# Altium schematic sheet Sheet1_TLK.SchDoc
size A4 portrait; SheetNumber: 1; SheetTotal: 1
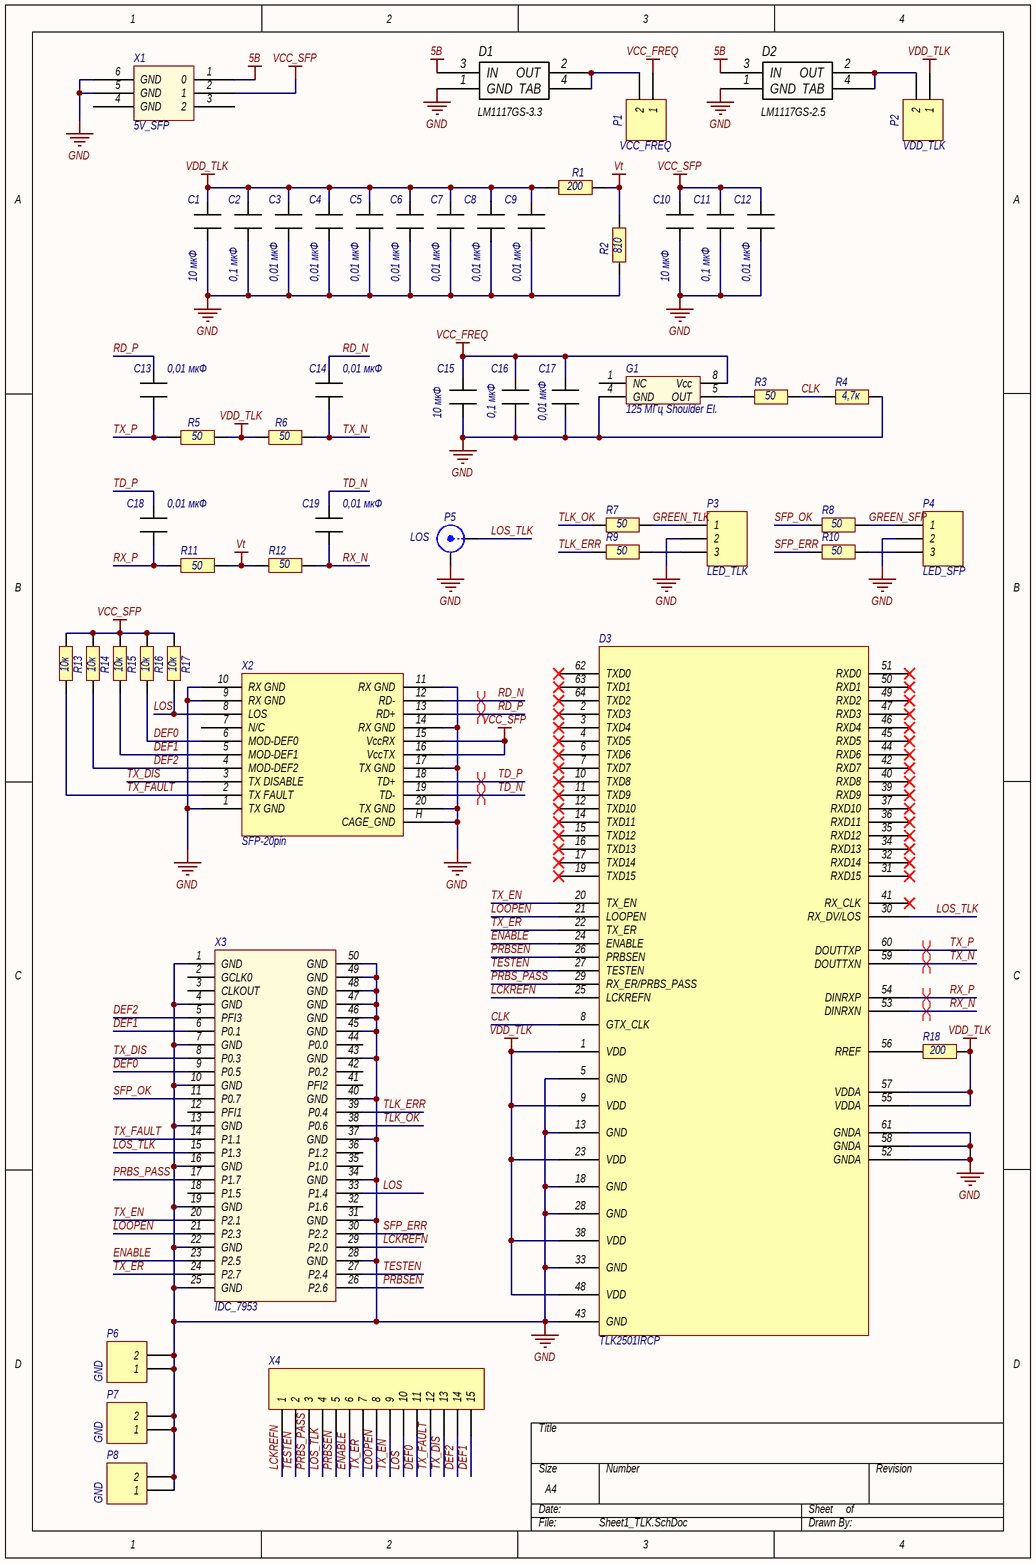
[diagram p0: Sheet1_TLK.SchDoc]

## Parts
C1  10 мкФ  [Cap_BIG]
C2  0,1 мкФ  [CAP_SMALL]
C3  0,01 мкФ  [CAP_SMALL]
C4  0,01 мкФ  [CAP_SMALL]
C5  0,01 мкФ  [CAP_SMALL]
C6  0,01 мкФ  [CAP_SMALL]
C7  0,01 мкФ  [CAP_SMALL]
C8  0,01 мкФ  [CAP_SMALL]
C9  0,01 мкФ  [CAP_SMALL]
C10  10 мкФ  [Cap_BIG]
C11  0,1 мкФ  [CAP_SMALL]
C12  0,01 мкФ  [CAP_SMALL]
C13  0,01 мкФ  [CAP_SMALL]
C14  0,01 мкФ  [CAP_SMALL]
C15  10 мкФ  [Cap_BIG]
C16  0,1 мкФ  [CAP_SMALL]
C17  0,01 мкФ  [CAP_SMALL]
C18  0,01 мкФ  [CAP_SMALL]
C19  0,01 мкФ  [CAP_SMALL]
D1  LM1117GS-3.3  [LM1117_SOT223]
D2  LM1117GS-2.5  [LM1117_SOT223]
D3  TLK2501IRCP  [Quad64]
G1  125 МГц Shoulder El.  [HALF]
P1  VCC_FREQ  [HDR1X2]
P2  VDD_TLK  [HDR1X2]
P3  LED_TLK  [HDR1X3]
P4  LED_SFP  [HDR1X3]
P5  LOS  [BNC_RA CON]
P6  GND  [HDR1X2]
P7  GND  [HDR1X2]
P8  GND  [HDR1X2]
R1  200  [RES]
R2  810  [RES]
R3  50  [RES]
R4  4,7к  [RES]
R5  50  [RES]
R6  50  [RES]
R7  50  [RES]
R8  50  [RES]
R9  50  [RES]
R10  50  [RES]
R11  50  [RES]
R12  50  [RES]
R13  10к  [RES]
R14  10к  [RES]
R15  10к  [RES]
R16  10к  [RES]
R17  10к  [RES]
R18  200  [RES]
X1  5V_SFP  [POWER]
X2  SFP-20pin  [SFP-20pin]
X3  IDC_7953  [IDC_7953]
X4  Header 15  [HDR1X15]  (value not drawn)

## Nets
5В: D1.3(IN) D2.3(IN) X1.1(0)
GND: C1.1 C2.1 C3.1 C4.1 C5.1 C6.1 C7.1 C8.1 C9.1 C10.1 C11.1 C12.1 C15.1 C16.1 C17.1 D1.1(GND) D2.1(GND) D3.5(GND) D3.13(GND) D3.18(GND) D3.28(GND) D3.33(GND) D3.43(GND) D3.52(GNDA) D3.58(GNDA) D3.61(GNDA) G1.4(GND) P3.2 P4.2 P5.2(Y) P6.1 P6.2 P7.1 P7.2 P8.1 P8.2 R2.1 R4.2 X1.5(GND) X1.6(GND) X2.1(TX_GND) X2.9(RX_GND) X2.10(RX_GND) X2.11(RX_GND) X2.14(RX_GND) X2.17(TX_GND) X2.20(TX_GND) X2.H(CAGE_GND) X3.1(GND) X3.4(GND) X3.7(GND) X3.10(GND) X3.13(GND) X3.16(GND) X3.19(GND) X3.22(GND) X3.25(GND) X3.28(GND) X3.31(GND) X3.34(GND) X3.37(GND) X3.40(GND) X3.43(GND) X3.45(GND) X3.46(GND) X3.47(GND) X3.48(GND) X3.49(GND) X3.50(GND)
VCC_FREQ: C15.2 C16.2 C17.2 G1.8(Vcc) P1.1
VCC_SFP: C10.2 C11.2 C12.2 R13.2 R14.2 R15.2 R16.2 R17.2 X1.2(1) X2.15(VccRX) X2.16(VccTX)
VDD_TLK: C1.2 C2.2 C3.2 C4.2 C5.2 C6.2 C7.2 C8.2 C9.2 D3.1(VDD) D3.9(VDD) D3.23(VDD) D3.38(VDD) D3.48(VDD) D3.55(VDDA) D3.57(VDDA) P2.1 R1.2 R5.2 R6.1 R18.2
Vt: R1.1 R2.2 R11.2 R12.1
CLK: D3.8(GTX_CLK) R3.2 R4.1
DEF0: R16.1 X2.6(MOD-DEF0) X3.9(P0.5) X4.11
DEF1: R15.1 X2.5(MOD-DEF1) X3.6(P0.1) X4.15
DEF2: R14.1 X2.4(MOD-DEF2) X3.5(PFI3) X4.14
ENABLE: D3.24(ENABLE) X3.23(P2.5) X4.6
GREEN_SFP: P4.1 R8.2
GREEN_TLK: P3.1 R7.2
LCKREFN: D3.25(LCKREFN) X3.29(P2.0) X4.1
LOOPEN: D3.21(LOOPEN) X3.21(P2.3) X4.8
LOS: R17.1 X2.8(LOS) X3.33(P1.4) X4.10
LOS_TLK: D3.30(RX_DV/LOS) P5.1(X) X3.15(P1.3) X4.4
PRBS_PASS: D3.29(RX_ER/PRBS_PASS) X3.17(P1.7) X4.3
PRBSEN: D3.26(PRBSEN) X3.26(P2.6) X4.5
RD_N: C14.2 X2.12(RD-)
RD_P: C13.2 X2.13(RD+)
RX_N: C19.1 D3.53(DINRXN) R12.2
RX_P: C18.1 D3.54(DINRXP) R11.1
SFP_ERR: R10.1 X3.30(P2.2)
SFP_OK: R8.1 X3.11(P0.7)
TD_N: C19.2 X2.19(TD-)
TD_P: C18.2 X2.18(TD+)
TESTEN: D3.27(TESTEN) X3.27(P2.4) X4.2
TLK_ERR: R9.1 X3.39(P0.4)
TLK_OK: R7.1 X3.38(P0.6)
TX_DIS: X2.3(TX_DISABLE) X3.8(P0.3) X4.13
TX_EN: D3.20(TX_EN) X3.20(P2.1) X4.9
TX_ER: D3.22(TX_ER) X3.24(P2.7) X4.7
TX_FAULT: R13.1 X2.2(TX_FAULT) X3.14(P1.1) X4.12
TX_N: C14.1 D3.59(DOUTTXN) R6.2
TX_P: C13.1 D3.60(DOUTTXP) R5.1
NetD1_2: D1.2(OUT) D1.4(TAB) P1.2
NetD2_2: D2.2(OUT) D2.4(TAB) P2.2
NetD3_56: D3.56(RREF) R18.1
NetG1_5: G1.5(OUT) R3.1
NetP3_3: P3.3 R9.2
NetP4_3: P4.3 R10.2

Not connected (* = marked no-connect by the designer): D3 2(TXD3)* 3(TXD4)* 4(TXD5)* 6(TXD6)* 7(TXD7)* 10(TXD8)* 11(TXD9)* 12(TXD10)* 14(TXD11)* 15(TXD12)* 16(TXD13)* 17(TXD14)* 19(TXD15)* 31(RXD15)* 32(RXD14)* 34(RXD13)* 35(RXD12)* 36(RXD11)* 37(RXD10)* 39(RXD9)* 40(RXD8)* 41(RX_CLK)* 42(RXD7)* 44(RXD6)* 45(RXD5)* 46(RXD4)* 47(RXD3)* 49(RXD2)* 50(RXD1)* 51(RXD0)* 62(TXD0)* 63(TXD1)* 64(TXD2)*; G1 1(NC); X1 3(2) 4(GND); X2 7(N/C); X3 2(GCLK0) 3(CLKOUT) 12(PFI1) 18(P1.5) 32(P1.6) 35(P1.0) 36(P1.2) 41(PFI2) 42(P0.2) 44(P0.0)

## Layout directives
differential pair: RD_N, RD_P, RX_N, RX_P, TD_N, TD_P, TX_N, TX_P

## Library data of the parts
C1 C10 C15 = CAP_BIG
C2-C9 C11-C14 C16-C19 = CAP_SMALL
D1 = LM1117GS-3.3: Стабилизатор напряжения 3,3В
D2 = LM1117GS-2.5: Стабилизатор напряжения 2,5В
P1 P2 P6-P8 = Header 2: Header, 2-Pin; LatestRevisionDate: 17-Jul-2002; LatestRevisionNote: Re-released for DXP Platform.; Publisher: Altium Limited
P3 P4 = Header 3: Header, 3-Pin; LatestRevisionDate: 17-Jul-2002; LatestRevisionNote: Re-released for DXP Platform.; Publisher: Altium Limited
P5 = BNC: BNC Elbow Connector; LatestRevisionDate: 17-Jul-2002; LatestRevisionNote: Re-released for DXP Platform.; Publisher: Altium Limited
R1-R18 = RES
X1 = POWER
X4 = Header 15: Header, 15-Pin; LatestRevisionDate: 17-Jul-2002; LatestRevisionNote: Re-released for DXP Platform.; Publisher: Altium Limited